# Altium schematic sheet Power_Supply_HV.SchDoc
size A4; CompanyName: Technische Hochschule Nürnberg Georg Simon Ohm; Address1: Fürther Straße 250; Address2: 90429 Nürnberg; Address3: GERMANY; SheetNumber: 3; SheetTotal: 3; CompanyName2: Institut ELSYS
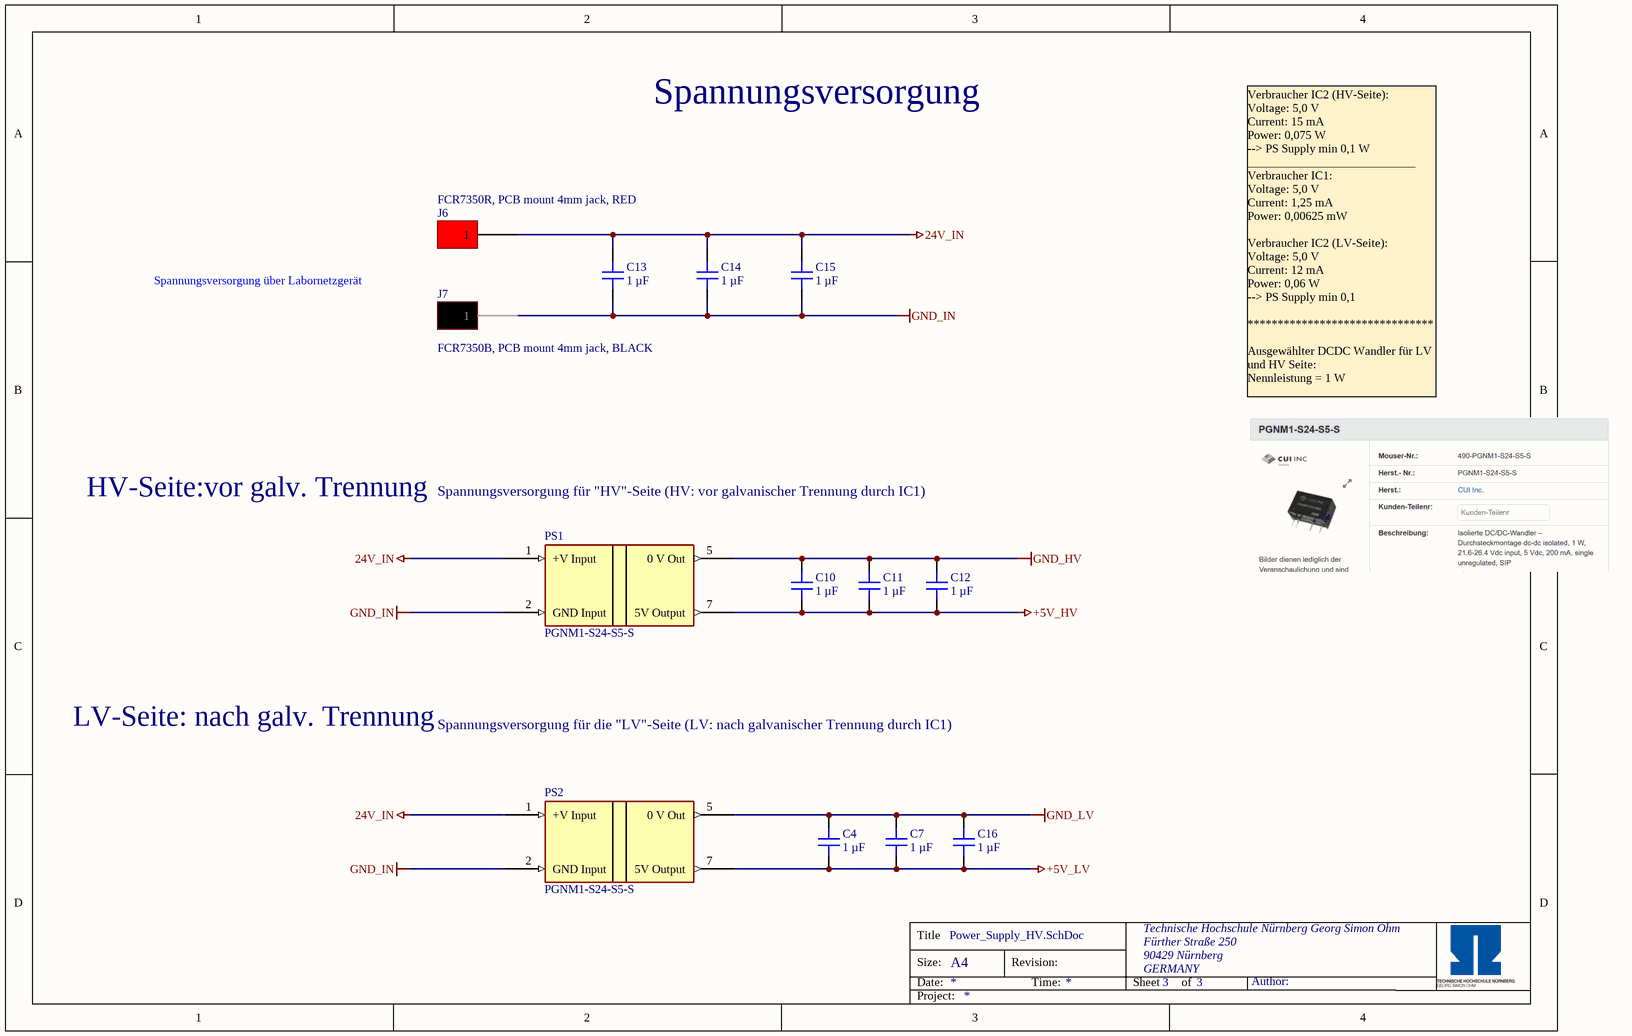
[diagram p0: Power_Supply_HV.SchDoc]

## Parts
C4  1 µF  [C_0603]
C7  1 µF  [C_0603]
C10  1 µF  [C_0603]
C11  1 µF  [C_0603]
C12  1 µF  [C_0603]
C13  1 µF  [C_0603]
C14  1 µF  [C_0603]
C15  1 µF  [C_0603]
C16  1 µF  [C_0603]
J6  FCR7350R, PCB mount 4mm jack, RED  [FCR7350]
J7  FCR7350B, PCB mount 4mm jack, BLACK  [FCR7350]
PS1  PGNM1-S24-S5-S  [PGNM1-S24-S5-S]
PS2  PGNM1-S24-S5-S  [PGNM1-S24-S5-S]

## Nets
24V_IN: C13.1 C14.1 C15.1 J6.1 PS1.1(+V_Input) PS2.1(+V_Input)
+5V_HV: C10.2 C11.2 C12.2 PS1.7(5V_Output)
+5V_LV: C4.1 C7.1 C16.1 PS2.7(5V_Output)
GND_HV: C10.1 C11.1 C12.1 PS1.5(0_V_Out)
GND_IN: C13.2 C14.2 C15.2 J7.1 PS1.2(GND_Input) PS2.2(GND_Input)
GND_LV: C4.2 C7.2 C16.2 PS2.5(0_V_Out)

## Notes on the sheet
- Spannungsversorgung
- Spannungsversorgung über Labornetzgerät
- Verbraucher IC2 (HV-Seite):
  Voltage: 5,0 V
  Current: 15 mA
  Power: 0,075 W
  --> PS Supply min 0,1 W
  ____________________________
  Verbraucher IC1:
  Voltage: 5,0 V
  Current: 1,25 mA
  Power: 0,00625 mW
  Verbraucher IC2 (LV-Seite):
  Voltage: 5,0 V
  Current: 12 mA
  Power: 0,06 W
  --> PS Supply min 0,1
  *******************************
  Ausgewählter DCDC Wandler für LV und HV Seite:
  Nennleistung = 1 W
- HV-Seite:vor galv. Trennung
- Spannungsversorgung für "HV"-Seite (HV: vor galvanischer Trennung durch IC1)
- LV-Seite: nach galv. Trennung
- Spannungsversorgung für die "LV"-Seite (LV: nach galvanischer Trennung durch IC1)
- Title
- Size:
- Date:
- A4
- Revision:
- Time:
- Sheet
- of
- Author:
- Project:

## Library data of the parts
C4 C7 C10-C16 = CL10A105KB8NNNC: 50V 1uF X5R ±10% 0603  Multilayer Ceramic Capacitors MLCC - SMD/SMT ROHS; Manufacturer: Samsung Electro-Mechanics; Voltage Rating: 50 VDC; Created from: MGremer; Supplier 1: LCSC; Supplier Part Number 1: C15849; Manufacturer Part Number: CL10A105KB8NNNC; Value: 1 µF; PartID: 5; Created On: 20.12.2020 13:54:13; ComponentLink1Description: Datasheet; ComponentLink1URL: https://datasheet.lcsc.com/lcsc/1810261812_Samsung-Electro-Mechanics-CL10A105KB8NNNC_C15849.pdf; Component Type: Capacitor 0603; Device Package: 0603; Last Updated: 28.11.2022 17:23:01; Mounting Type: SMD; Operating Temperature: -55 - 85°C; Series: M; Type: Capacitor; Tolerance: 10 %; Live Cycle Status: 1; LCSC Part Number: C15849; Stock number: Labor SMD Container
J6 = FCR7350R: FCR7350B, 1000V, 24A, RED; Manufacturer: Cliff; Value: PCB mount 4mm jack, Red FCR7350R, 1000V, 24A; Created from: DHufnagel; Manufacturer Part Number: FCR7350R; PartID: 7; Created On: 13.06.2022 10:18:11; ComponentLink1Description: datasheet; ComponentLink1URL: https://www.cliffuk.co.uk/products/testleads/sockets/S16NPC.pdf; ComponentLink2Description: drawing; ComponentLink2URL: https://media.digikey.com/pdf/Data%20Sheets/Cliff%20Electronic%20LTD%20PDF's/FCR7350_Drawing.pdf; Component Type: PCB mount 4mm jack, Red; Device Package: THT; Last Updated: 28.06.2022 13:58:37; Minimum Order: 1; Mounting Type: THT; Operating Temperature: -40°C - 80°C; Series: S16N-PC; Supplier 1: Digi-Key; Supplier Part Number 1: 3185-FCR7350R-ND; Supplier 2: farnell; Supplier Part Number 2: 1854508; Type: PCB mount 4mm jack, Red FCR7350R, 1000V, 24A; Live Cycle Status: 1; Stock number: not stored
J7 = FCR7350B: FCR7350B, 1000V, 24A, BLACK; Manufacturer: Cliff; Value: PCB mount 4mm jack, Black	FCR7350B, 1000V, 24A; Created from: DHufnagel; Manufacturer Part Number: FCR7350B; PartID: 6; Created On: 13.06.2022 10:18:11; ComponentLink1Description: datasheet; ComponentLink1URL: https://www.cliffuk.co.uk/products/testleads/sockets/S16NPC.pdf; ComponentLink2Description: drawing; ComponentLink2URL: https://media.digikey.com/pdf/Data%20Sheets/Cliff%20Electronic%20LTD%20PDF's/FCR7350_Drawing.pdf; Component Type: PCB mount 4mm jack, Black; Device Package: THT; Last Updated: 28.06.2022 13:58:37; Minimum Order: 1; Mounting Type: THT; Operating Temperature: -40°C - 80°C; Series: S16N-PC; Supplier 1: Digi-Key; Supplier Part Number 1: 3185-FCR7350B-ND; Supplier 2: farnell; Supplier Part Number 2: 1854507; Type: PCB mount 4mm jack, Black	FCR7350B, 1000V, 24A; Live Cycle Status: 1; Stock number: not stored
PS1 PS2 = PGNM1-S24-S5-S: Isolierte DC/DC-Wandler – Durchsteckmontage dc-dc isolated, 1 W, 21.6-26.4 Vdc input, 5 Vdc, 200 mA, single unregulated, SIP; Parameter 1: *; Supplier 1: Mouser; Supplier Part Number 1: 490-PGNM1-S24-S5-S